# EAGLE design monoblink_wifi_v2 (EAGLE 9.2.0)
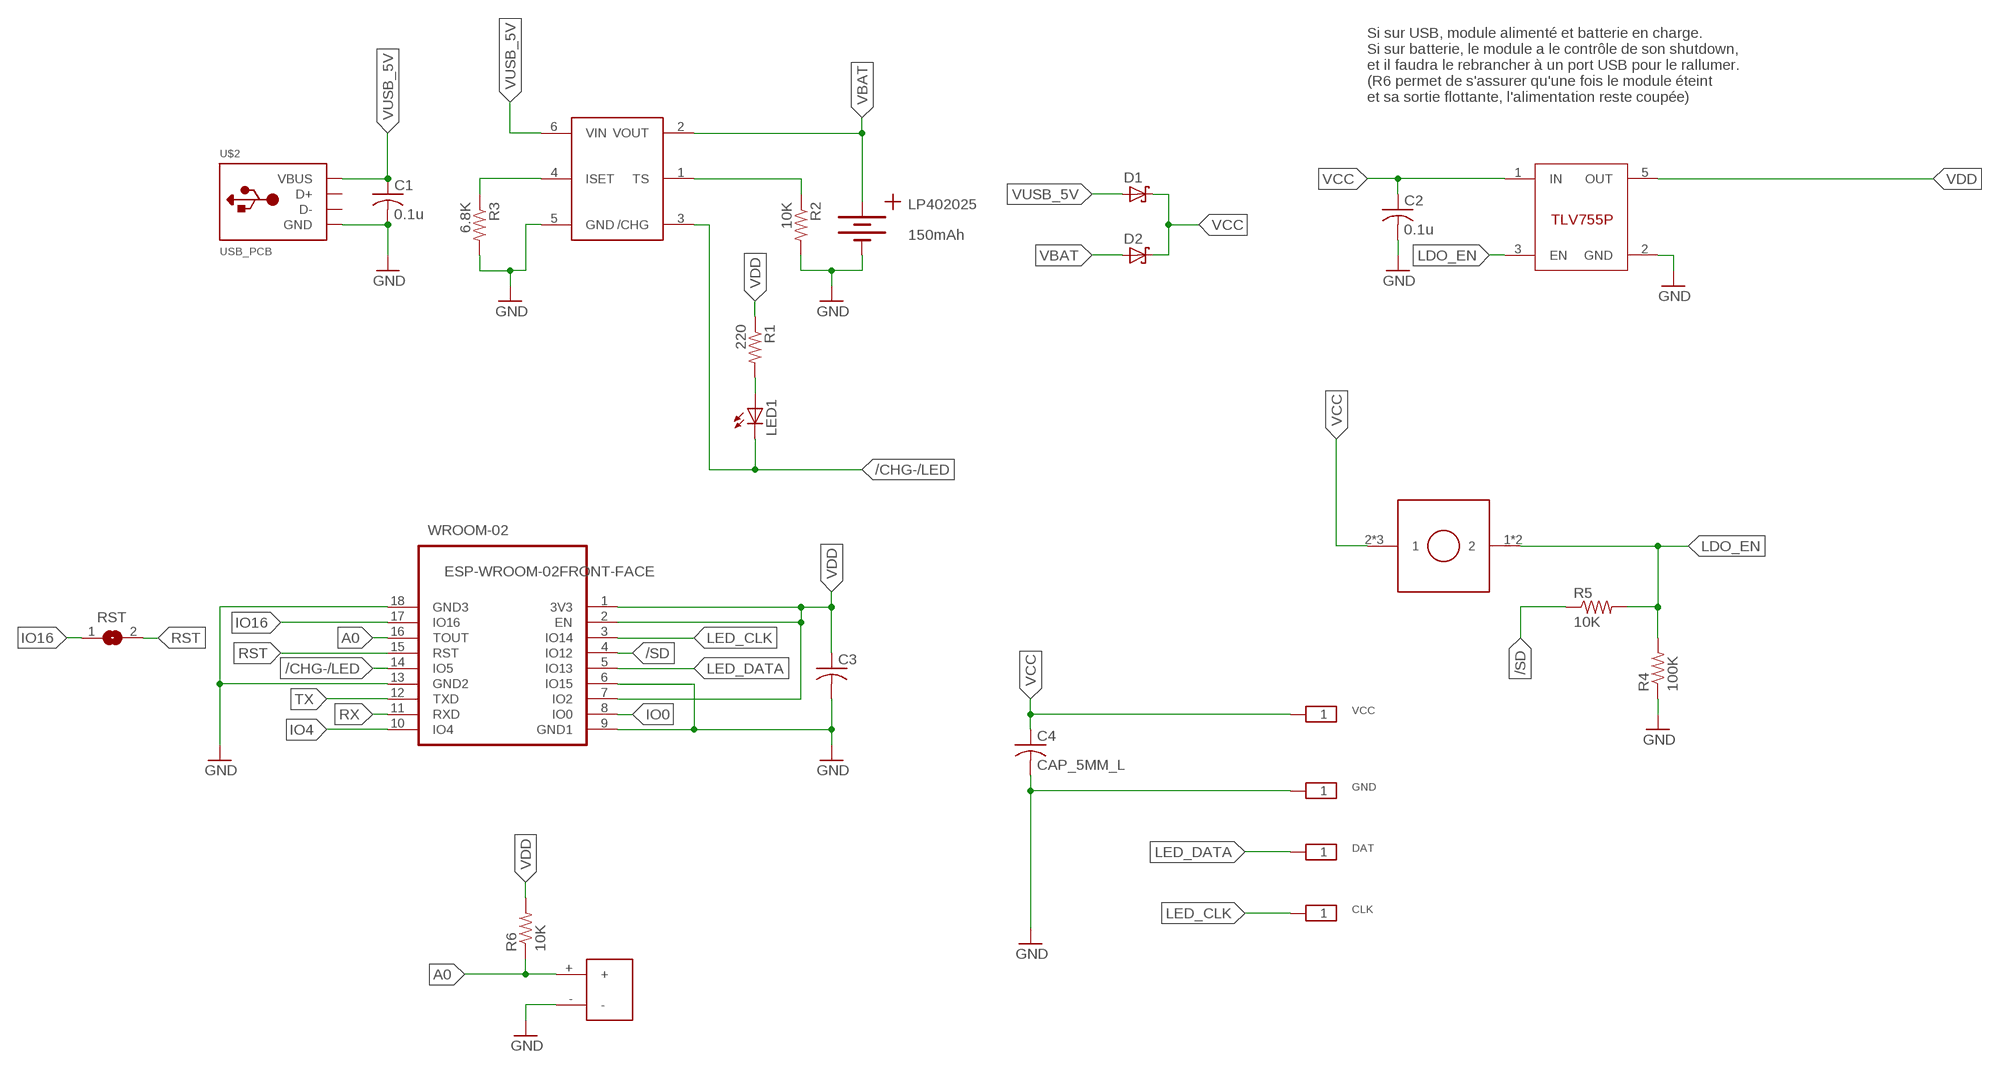
[diagram p0: schematic, sheet 1]

## Parts
C1  0.1u  C-USC0603  [C0603]
C2  0.1u  C-USC0603  [C0603]
C3  C-USC0603  [C0603]
C4  CAP_5MM_L  [TT2D5L]
CHG  BQ21040  [SOT23-6]
CLK  TESTPAD_PROGSPRING_PIN  [MATRIX_CONN]
D1  NSR0320MW2T1G  [SOD323]
D2  NSR0320MW2T1G  [SOD323]
DAT  TESTPAD_PROGSPRING_PIN  [MATRIX_CONN]
GND  TESTPAD_PROGSPRING_PIN  [MATRIX_CONN]
LDO  TLV755P  [SOT23-5]
LED1  LEDCHIP-LED0603  [CHIP-LED0603]
LP402025  150mAh  BATT  [BATT_CON]
ON/OFF  KMS231GPLFSNO_PEGS  [KMS231GLFS]
R1  220  R-US_R0603  [R0603]
R2  10K  R-US_R0603  [R0603]
R3  6.8K  R-US_R0603  [R0603]
R4  100K  R-US_R0603  [R0603]
R5  10K  R-US_R0603  [R0603]
R6  10K  R-US_R0603  [R0603]
RST  SOLDERJUMPER  [SOLDERJUMPER_ARROW_NOPASTE]
U$1  2PIN_STD  [2PIN_STD]
U$2  USB_PCB  [USB_PADS]
VCC  TESTPAD_PROGSPRING_PIN  [MATRIX_CONN]
WROOM-02  ESP-WROOM-02FRONT-FACE  [FRONT-FACE]

## Nets
/CHG-/LED: CHG.3(/CHG) LED1.C WROOM-02.14(IO5)
/SD: R5.1 WROOM-02.4(IO12)
A0: R6.1 U$1.+ WROOM-02.16(TOUT)
GND: C1.2 C2.2 C3.2 C4.- CHG.5(GND) GND.1 LDO.2(GND) LP402025.V-(-) R2.2 R3.2 R4.1 U$1.- U$2.GND WROOM-02.6(IO15) WROOM-02.9(GND1) WROOM-02.13(GND2) WROOM-02.18(GND3)
IO0: WROOM-02.8(IO0)
IO4: WROOM-02.10(IO4)
IO16: RST.1 WROOM-02.17(IO16)
ISET: CHG.4(ISET) R3.1
LDO_EN: LDO.3(EN) ON/OFF.1 ON/OFF.5 R4.2 R5.2
LED_CLK: CLK.1 WROOM-02.3(IO14)
LED_DATA: DAT.1 WROOM-02.5(IO13)
N$1: LED1.A R1.2
RST: RST.2 WROOM-02.15(RST)
RX: WROOM-02.11(RXD)
TS: CHG.1(TS) R2.1
TX: WROOM-02.12(TXD)
VBAT: CHG.2(VOUT) D2.2(A) LP402025.V+(+)
VCC: C2.1 C4.+ D1.1(C) D2.1(C) LDO.1(IN) ON/OFF.2 ON/OFF.3 ON/OFF.4 VCC.1
VDD: C3.1 LDO.5(OUT) R1.1 R6.2 WROOM-02.1(3V3) WROOM-02.2(EN) WROOM-02.7(IO2)
VUSB_5V: C1.1 CHG.6(VIN) D1.2(A) U$2.V_SUPPLY(VBUS)
Unconnected: U$2.D+ U$2.D-

## Notes on the sheet
- Si sur USB, module alimenté et batterie en charge.
  Si sur batterie, le module a le contrôle de son shutdown,
  et il faudra le rebrancher à un port USB pour le rallumer.
  (R6 permet de s'assurer qu'une fois le module éteint
  et sa sortie flottante, l'alimentation reste coupée)

## Library data of the parts
C1-C3 = monoblink_wifi:C-US: CAPACITOR, American symbol; SPICEPREFIX: C
C4 = monoblink_wifi:CAP_5MM_L
CHG = monoblink_wifi:BQ21040
CLK DAT GND VCC = monoblink_wifi:TESTPAD_PROG: TESTPAD
D1 D2 = monoblink_wifi:NSR0320MW2T1G
LDO = monoblink_wifi:TLV755P
LED1 = adafruit:LED: LED OSRAM: - CHIPLED LG R971, LG N971, LY N971, LG Q971, LY Q971, LO R971, LY R971 LH N974, LH R974 LS Q976, LO Q976, LY Q976 LO Q996 - Hyper CHIPLED LW Q18S LB Q993, LB Q99A, LB R99A - SideLED LS A670, LO A670, LY A670, LG A670, LP A670 LB A673, LV A673, LT A673, LW A673 LH A674 LY A675 LS A676, LA A676, LO A676, LY A676, LW A676 LS A679, LY A679, LG A679 - Hyper Micro SIDELED® LS Y876, LA Y876, LO Y876, LY Y876 LT Y87S - SmartLED LW L88C, LW L88S LB L89C, LB L89S, LG L890 LS L89K, LO L89K, LY L89K LS L896, LA L896, LO L896, LY L896 - TOPLED LS T670, LO T670, LY T670, LG T670, LP T670 LSG T670, LSP T670, LSY T670, LOP T670, LYG T670 LG T671, LOG T671, LSG T671 LB T673, LV T673, LT T673, LW T673 LH T674 LS T676, LA T676, LO T676, LY T676, LB T676, LH T676, LSB T676, LW T676 LB T67C, LV T67C, LT T67C, LS T67K, LO T67K, LY T67K, LW E67C LS E67B, LA E67B, LO E67B, LY E67B, LB E67C, LV E67C, LT E67C LW T67C LS T679, LY T679, LG T679 LS T770, LO T770, LY T770, LG T770, LP T770 LB T773, LV T773, LT T773, LW T773 LH T774 LS E675, LA E675, LY E675, LS T675 LS T776, LA T776, LO T776, LY T776, LB T776 LHGB T686 LT T68C, LB T68C - Hyper Mini TOPLED® LB M676 - Mini TOPLED Santana® LG M470 LS M47K, LO M47K, LY M47K Source: http://www.osram.convergy.de/
LP402025 = monoblink_wifi:BATT
ON/OFF = monoblink_wifi:KMS231GPLFS
R1-R6 = monoblink_wifi:R-US_: RESISTOR, American symbol; SPICEPREFIX: R
RST = monoblink_wifi:SOLDERJUMPER: SMD Solder JUMPER Solder the two pads together to create a connection, or remove the solder to break it. REFLOW - Use this footprint for solder paste and reflow ovens. WAVE - Use this footprint for hand-soldering (larger pads). CLOSED - Has a trace between the two pads to ensure it is closed by default. The trace needs to be cut to disable the jumper, and can be closed again by creating a solder bridge between the two pads.; BOM: EXCLUDE
U$1 = monoblink_wifi:2PIN_STD
U$2 = monoblink_wifi:USB_PCB
WROOM-02 = monoblink_wifi:ESP-WROOM-02: WiFi module - ESP-WROOM-02

## Board
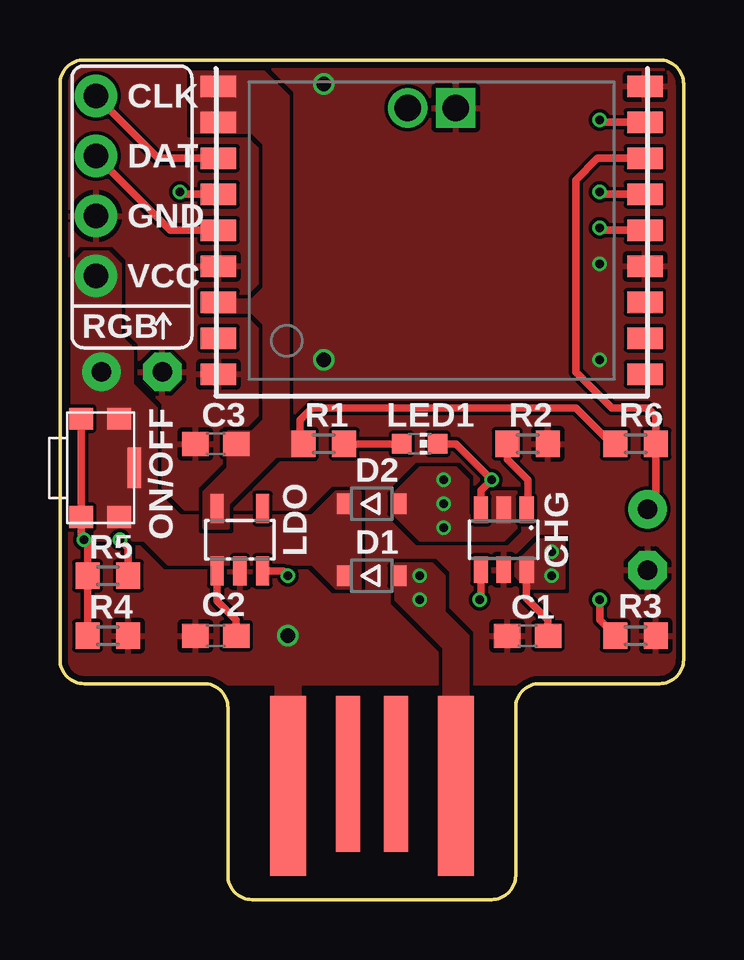
[diagram p1: board, top side]
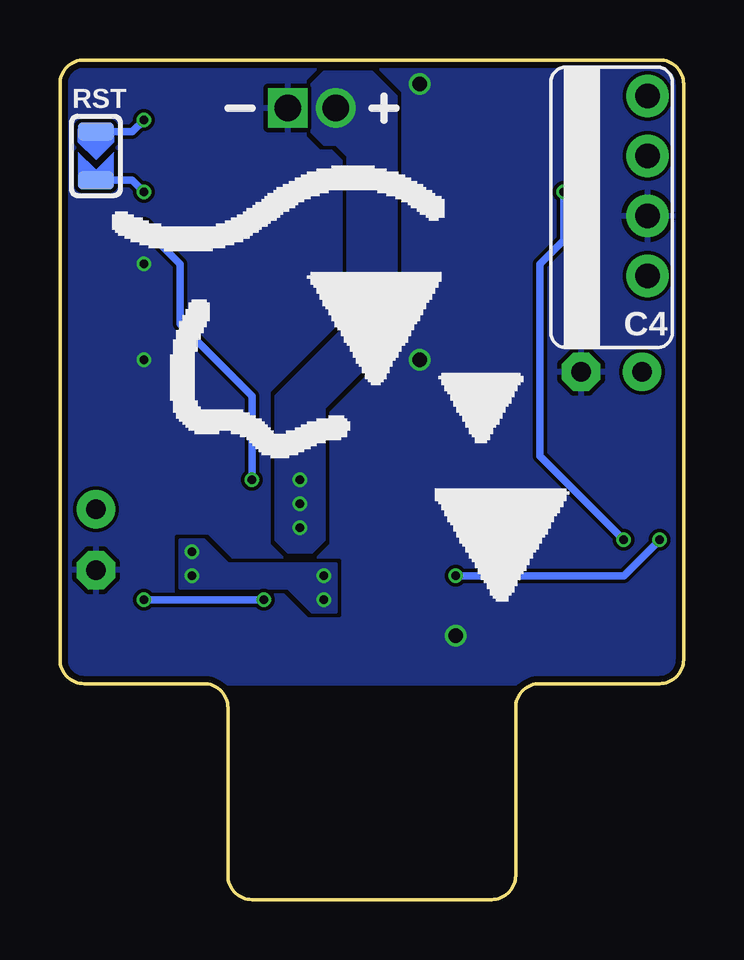
[diagram p2: board, bottom side, seen from below]

Size 26 x 35 mm. Coordinates in mm from the lower left corner, seen from the top.
Outline: 7,8 7,1 arc90 8,0 18,0 arc90 19,1 19,8 arc-90 20,9 25,9 arc90 26,10 26,34 arc90 25,35 1,35 arc90 0,34 0,10 arc90 1,9 6,9 arc-90 7,8
Copper layers (1*16): Top 0.018mm / dielectric 1.55mm / Bottom 0.018mm
Design rules "eC_2Layer_PClass6_BaseCopperO18_eCDefault": minimum track width 0.15mm, minimum drill 0.35mm, track to track 0.15mm, track to pad 0.15mm, pad to pad 0.15mm, via to via 0.15mm, smd to smd 0mil, copper to edge 0.25mm, drill to drill 0.35mm, minimum pad ring 0.175mm, minimum via ring 0.125mm, stop-mask expansion 0mil, vias tented up to drill 0.45mm, thermal gap 0.2mm

### Footprints (pad centres in the part's own frame; a part is rotated, then mirrored left to right if it is on the bottom)
C0603 = smd 1.1 x 1: 1 -0.85,0; 2 0.85,0
TT2D5L = drill 0.813 pad 1.6: + 1.27,0 | drill 0.813 pad 1.6 octagon: - -1.27,0
SOT23-6 = smd 0.6 x 1.1: 1 -0.95,-1.25; 2 0,-1.25; 3 0.95,-1.25; 4 0.95,1.25; 5 0,1.25; 6 -0.95,1.25
MATRIX_CONN = drill 1.016 pad 1.778: 1 0,0
SOD323 = smd 0.65 x 0.85: 1 -1.125,0; 2 1.125,0
SOT23-5 = smd 0.55 x 1.2: 1 -0.95,-1.3; 2 0,-1.3; 3 0.95,-1.3; 4 0.95,1.3; 5 -0.95,1.3
CHIP-LED0603 = smd 0.8 x 0.8: A 0,-0.75; C 0,0.75
BATT_CON = drill 1.1 pad 1.6: V+ 0,0 | drill 1.1 pad 1.6 square: V- 2,0
KMS231GLFS = smd 0.9 x 1: 1 -2.05,0.575; 2 -2.05,2.175; 4 2.05,2.175; 5 2.05,0.575 | smd 1.7 x 0.55: 3 0,2.8
R0603 = smd 1 x 1.1: 1 -0.85,0; 2 0.85,0
SOLDERJUMPER_ARROW_NOPASTE = smd 0.762 x 1.524: 1 -1.016,0; 2 1.016,0
2PIN_STD = drill 0.813 pad 1.6: + 1.27,0 | drill 0.813 pad 1.6 octagon: - -1.27,0
USB_PADS = smd 1 x 6.5: D+ 1,3.25; D- -1,3.25 | smd 1.5 x 7.5: GND 3.5,3.75; V_SUPPLY -3.5,3.75
FRONT-FACE = smd 1.485 x 0.9: 1 -8.893,4.9; 2 -8.893,3.4; 3 -8.893,1.9; 4 -8.893,0.4; 5 -8.893,-1.1; 6 -8.893,-2.6; 7 -8.893,-4.1; 8 -8.893,-5.6; 9 -8.893,-7.1; 10 8.893,-7.1; 11 8.893,-5.6; 12 8.893,-4.1; 13 8.893,-2.6; 14 8.893,-1.1; 15 8.893,0.4; 16 8.893,1.9; 17 8.893,3.4; 18 8.893,4.9

### Placement (x,y rotation side)
C1  19.5,11 180 top
C2  6.5,11 180 top
C3  6.5,19 180 top
C4  3,22 0 bottom
CHG  18.5,15 180 top
CLK  1.5,33.5 270 top
D1  13,13.5 0 top
D2  13,16.5 0 top
DAT  1.5,31 270 top
GND  1.5,28.5 270 top
LDO  7.5,15 0 top
LED1  15,19 270 top
LP402025  14.5,33 0 top
ON/OFF  0.3,18 270 top
R1  11,19 0 top
R2  19.5,19 0 top
R3  24,11 0 top
R4  2,11 180 top
R5  2,13.5 180 top
R6  24,19 180 top
RST  24.5,31 270 bottom
U$1  24.5,15 90 top
U$2  13,8.5 180 top
VCC  1.5,26 270 top
WROOM-02  15.5,29 0 top

### Tracks (layer width: path | path; a pad name or v marks a point on that pad's centre or on a via)
/CHG-/LED  (via drill 0.35)
  Top 0.305: CHG.3 17.55,17.05 v18,17.5 16.5,19 LED1.C | WROOM-02.14 22.6,27.9 v22.5,28
  Bottom 0.305: v18,17.5 18,21 21,24 21,26.5 v22.5,28
/SD  (via drill 0.35)
  Top 0.305: R5.1 2.85,14.65 v2.5,15 | v5,29.5 5.1,29.4 WROOM-02.4
  Bottom 0.305: v2.5,15 6,18.5 6,26.5 5,27.5 v5,29.5
A0
  Top 0.305: U$1.+ 24.85,16.62 R6.1 24.85,20.15 24.5,20.5 23,20.5 21.5,22 21.5,30 22.4,30.9 WROOM-02.16
GND  (via drill 0.35, 0.6 pad 0.8)
  other vias: 22.5,26.5 22.5,22.5 9.5,11 11,22.5 11,34
  pour Top (rank 3): -0.5,35.5 26.5,35.5 26.5,9 -0.5,9
  pour Bottom (rank 2): -0.5,35.5 26.5,35.5 26.5,9 -0.5,9
  pour Top (no thermals): 9,8 10,8 10,9.5 9,9.5
IO16  (via drill 0.35)
  Top 0.305: WROOM-02.17 22.6,32.4 v22.5,32.5
  Bottom 0.305: RST.1 22.98,32.02 v22.5,32.5
ISET  (via drill 0.35)
  Top 0.305: v22.5,12.5 22.5,11.65 R3.1 | CHG.4 17.55,12.55 v17.5,12.5
  Bottom 0.305: v17.5,12.5 v22.5,12.5
LDO_EN  (via drill 0.35)
  Top 0.305: ON/OFF.1 ON/OFF.5 0.88,15.12 v1,15 1.15,14.85 R5.2 R4.2 | v9.5,13.5 9.3,13.7 LDO.3
  Bottom 0.305: v1,15 2.5,13.5 v9.5,13.5
LED_CLK
  Top 0.305: WROOM-02.3 4.1,30.9 CLK.1
LED_DATA
  Top 0.305: WROOM-02.5 4.6,27.9 DAT.1
N$1
  Top 0.305: R1.2 LED1.A
RST  (via drill 0.35)
  Top 0.305: WROOM-02.15 22.6,29.4 v22.5,29.5
  Bottom 0.305: RST.2 22.98,29.98 v22.5,29.5
TS
  Top 0.305: CHG.1 19.5,16.3 19.5,17.5 18.65,18.35 R2.1
VBAT  (via drill 0.35)
  other vias: 16,17.5 16,16.5 16,15.5
  pour Top (no thermals): 14,17 14,16 15,15 18.5,15 19,15.5 19,17 18,17 18,16 17,16 17,17.5 16.5,18 15,18
  pour Bottom (no thermals): 17,15 16.5,14.5 15.5,14.5 15,15 15,20.5 12,23.5 12,33.5 13,34.5 15,34.5 15.5,34 15.5,32 15,31.5 14.5,31.5 14,31 14,24 17,21
VCC
  Top 0.305: 1.73,25.77 VCC.1 | LDO.1 6.55,12.45 7.35,11.65 C2.1
  pour Top (rank 2, no thermals): 12.5,17 12.5,13 11.5,13 10.5,14 4.5,14 3.5,15 0.5,15 0.5,26.5 1,27 2,27 2.5,26.5 2.5,23.5 3,23 3,21.5 4,20.5 4,17 5,16 10.5,16 11.5,17
VDD
  Top 0.305: 7.55,18.7 C3.1 | R1.1 10,19.15 10,20 10.5,20.5 | R6.2 23,19 21.5,20.5 10.5,20.5 | 10.51,20.5 10.5,20.5
  pour Top (no thermals): 7,19.5 7,18 6,17 6,15.5 7,15.5 7,16.5 9,18.5 10.5,18.5 10.5,19.5 9.5,19.5 9.5,33.5 8.5,34.5 5.5,34.5 5.5,32 8,32 8.5,31.5 8.5,25.5 8,25 6,25 6,24.5 8,24.5 8.5,24 8.5,20 8,19.5
VUSB_5V  (via drill 0.35)
  Top 0.305: CHG.6 19.45,12.55 20.35,11.65 C1.1
  other vias: 15,13.5 15,12.5 20.5,13.5 20.5,14.5
  pour Top (no thermals): 16,8 17,8 17,11 16,12 16,13.5 15.5,14 14,14 14,12.5 16,10.5
  pour Top (no thermals): 19,13.5 19,14 20,15 21,15 21,13 19.5,13
  pour Bottom (no thermals): 14.5,14 14.5,12 15.5,12 16.5,13 21,13 21,15 20,15 19,14

### Text on the board
tNames: RGB